# Altium project XDS100v3.PrjPcb
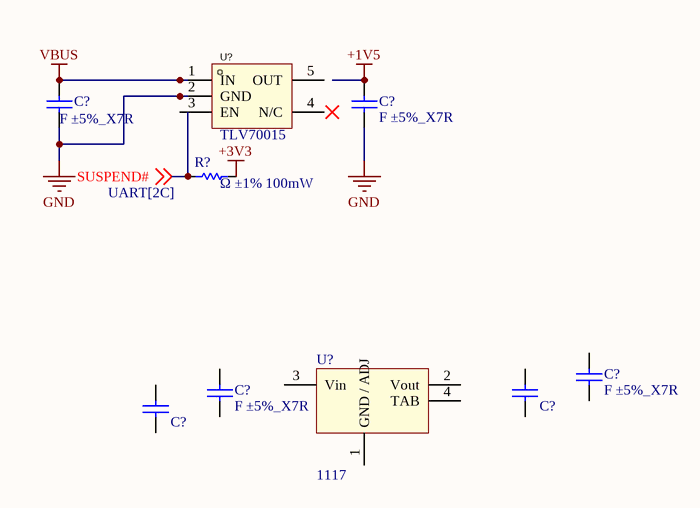
[diagram p0: Power.SchDoc]
5 sheets, 102 parts. Net scope: global (net labels, ports and power ports of the same name join across sheets).
Board file: XDS100v3.PcbDoc
Sheets:
  Power.SchDoc
  FPGA.SchDoc
  UART.SchDoc
  Port.SchDoc
  Others.SchDoc

## Sheet Power.SchDoc
size A4; SheetNumber: 1; SheetTotal: 5; SPICEModelCacheEWVEJELR: <root> / <DocumentId>EWVEJELR</DocumentId> / <CacheFrame Number="0"> / <Model Name="865250140002_22uf" Kind="CKT"> / <Text>******* / .subckt 865250140002_22uF 1 2 / Rser 1 3 2.79274851491 / Lser 2 4 9.31010869E-10 / C1 3 4 0.000022 / Rpar 3 4 2100000 / .ends 865250140002_22uF</Text> / </Model> / <Model Name="865250240001_10uf" Kind="CKT"> / <Text>******* / .subckt 865250240001_10uF 1 2 / Rser 1 3 1.93839512911 / Lser 2 4 8.46868376E-10 / C1 3 4 0.00001 / Rpar 3 4 3333333.33333333 / .ends 865250240001_10uF</Text> / </Model> / </CacheFrame> / </root>

### Parts
(Parts that share a designator on the sheet are numbered #1, #2 ... from top to bottom, then left to right.)
C?#1  F ±5%_X7R  [C0805]
C?#2  F ±5%_X7R  [C0805]
C?#3  F ±5%_X7R  [C0805]
C?#4  F ±5%_X7R  [C0805]
C?#5  22µF  [WCAP-ASNP_D4H5.5]  (value not drawn)
C?#6  10µF  [WCAP-ASNP_D4H5.5]  (value not drawn)
R?#1  Ω ±1% 100mW  [R0603]
U?#1  TLV70015  [SOT-23-5_L2.9-W1.6-P0.95-LS2.8-BR]
U?#2  1117  [SOT-223-3]

### Nets
+1V5: C?#2.2
+3V3: R?#1.1
GND: C?#1.1 C?#2.1 U?#1.2(GND)
VBUS: C?#1.2 U?#1.1(IN)
SUSPEND#: R?#1.2 ; off-sheet SUSPEND#

Not connected (* = marked no-connect by the designer): C?#3 1 2; C?#4 1 2; C?#5 1 2; C?#6 1 2; U?#1 3(EN) 4(N/C) 5(OUT); U?#2 1(GND_/_ADJ) 2(Vout) 3(Vin) 4(TAB)

### Library data of the parts
C?#1-C?#4 = Cap: Capacitor; Published: 8-Jun-2000; LatestRevisionDate: 17-Jul-2002; LatestRevisionNote: Re-released for DXP Platform.; PackageReference: RAD-0.3; Publisher: Altium Limited; PackageDescription: Radial Cap, Thru-Hole; 2 Leads; 0.3 in Pin Spacing
C?#5 = 865250140002: WCAP-ASNP Aluminum Electrolytic Capacitor, V-Chip, SMT, D4 x H5.5mm, 22µF, 6.3V; Manufacturer: Wurth Elektronik; Capacitance Tolerance: +/-20%; Dissipation Factor: 24%; Endurance: 2000h; Leakage Current: 10µA; Ripple Current: 28mA; Technical Reference: ASBB055220M6R3DVCTAB000; Manufacturer Part Number: 865250140002; Category: Aluminum Electrolytic Capacitors; Match Code: WCAP-ASNP; ComponentLink1Description: Website Link; ComponentLink1URL: https://www.we-online.com/redexpert/article/865250140002?ad; ComponentLink2Description: Datasheet Link; ComponentLink2URL: https://www.we-online.com/redexpert/spec/865250140002?ad; Mount: Surface Mount; Operating Temperature Max: 85°C; Operating Temperature Min: -40°C; Packaging: Tape and Reel; Case/Size Code: D4 x H5.5mm; Height: 5.5mm; Diameter: 4mm; Capacitance: 22µF; Rated Voltage (DC): 6.3V
C?#6 = 865250240001: WCAP-ASNP Aluminum Electrolytic Capacitor, V-Chip, SMT, D4 x H5.5mm, 10µF, 10V; Manufacturer: Wurth Elektronik; Capacitance Tolerance: +/-20%; Dissipation Factor: 20%; Endurance: 2000h; Leakage Current: 10µA; Ripple Current: 17mA; Technical Reference: ASBB055100M010DVCTAB000; Manufacturer Part Number: 865250240001; Category: Aluminum Electrolytic Capacitors; Match Code: WCAP-ASNP; ComponentLink1Description: Website Link; ComponentLink1URL: https://www.we-online.com/redexpert/article/865250240001?ad; ComponentLink2Description: Datasheet Link; ComponentLink2URL: https://www.we-online.com/redexpert/spec/865250240001?ad; Mount: Surface Mount; Operating Temperature Max: 85°C; Operating Temperature Min: -40°C; Packaging: Tape and Reel; Case/Size Code: D4 x H5.5mm; Height: 5.5mm; Diameter: 4mm; Capacitance: 10µF; Rated Voltage (DC): 10V
R?#1 = Res: Resistor; Published: 8-Jun-2000; LatestRevisionDate: 17-Jul-2002; LatestRevisionNote: Re-released for DXP Platform.; PackageReference: AXIAL-0.3; Publisher: Altium Limited; PackageDescription: Axial Device, Thru-Hole; 2 Leads; 0.3 in Pin Spacing
U?#1 = TLV70015: Manufacturer: TI(德州仪器); Name: TLV70015DDCR; Add into BOM: yes; Output Type: 固定; Output Polarity: 正; Number of Outputs: 1; Maximum Input Voltage: 5.5V; Output Voltage: 1.5V; Dropout Voltage: 250mV@(200mA); Quiescent Current (Ground Current): 55uA; Output Current: 200mA; Power Supply Rejection Ratio (PSRR): 68dB@(1kHz); Symbol: TLV70015DDCR; Device: TLV70015DDCR; LCSC Part Name: TLV70015DDCR; Supplier Part: C2865100; Manufacturer Part: TLV70015DDCR; Supplier Footprint: SOT-23-Thin-5; JLCPCB Part Class: Extended Part; Datasheet: https://atta.szlcsc.com/upload/public/pdf/source/20230221/CBA3FAF2ECD8317094AE1D26AA0CA23B.pdf; Supplier: LCSC; Convert to PCB: yes; Operating Temperature: -40℃~+125℃@(Tj)

## Sheet FPGA.SchDoc
size A4; SheetNumber: 2; SheetTotal: 5
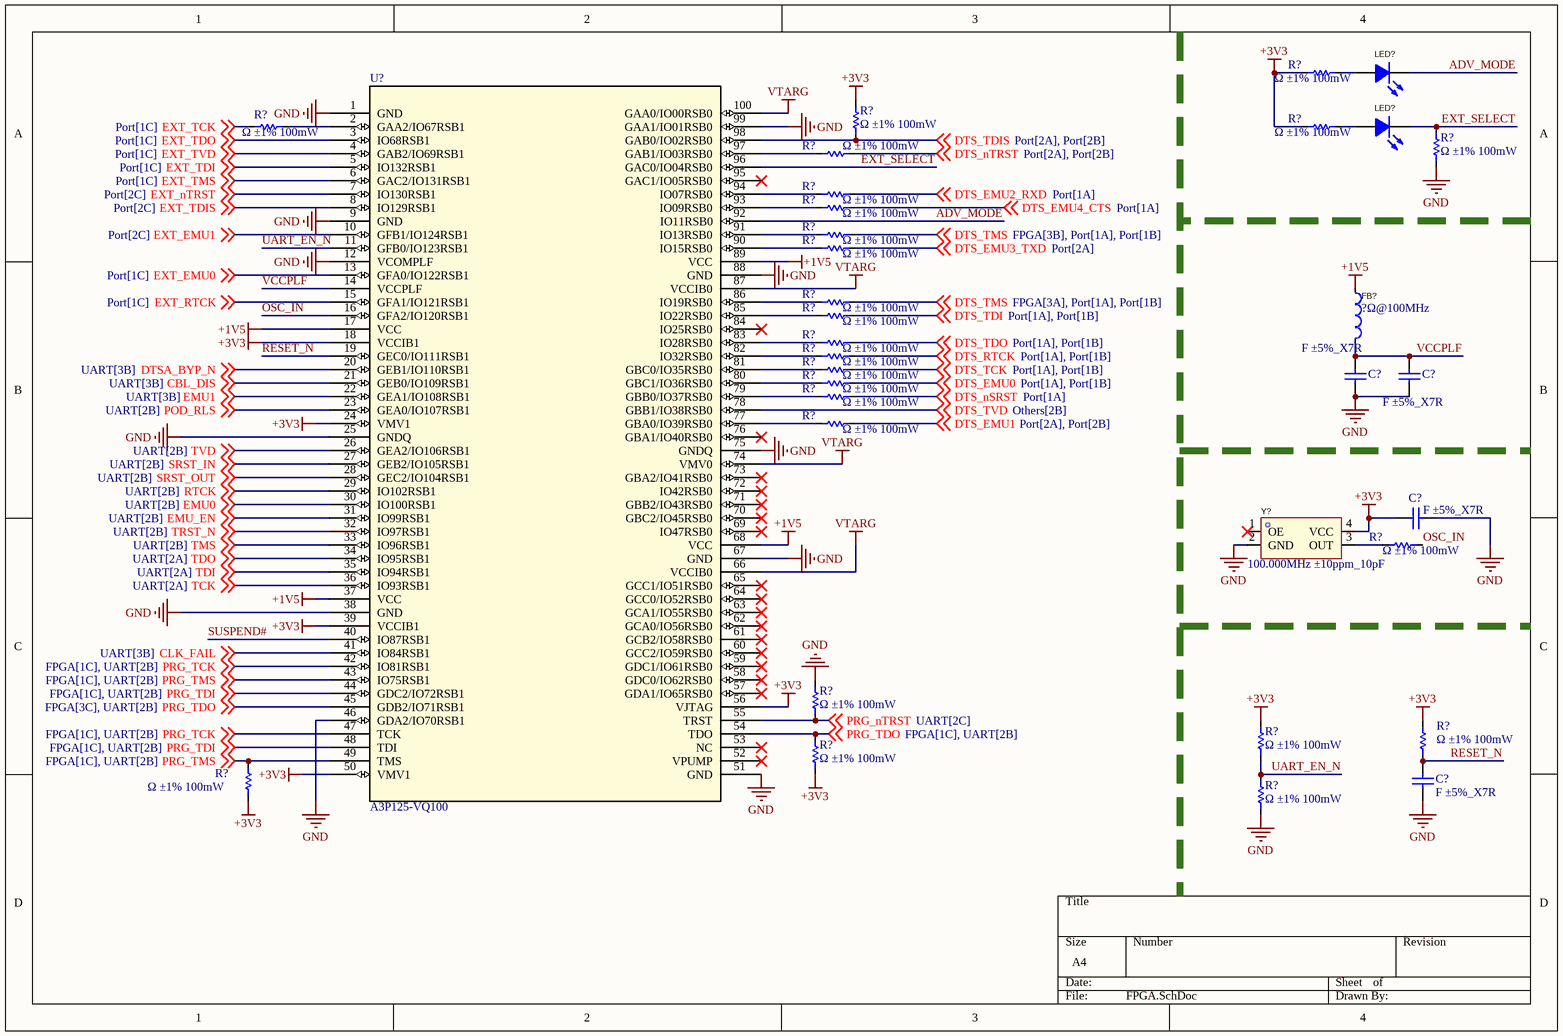
[diagram p1: FPGA.SchDoc]

### Parts
(Parts that share a designator on the sheet are numbered #1, #2 ... from top to bottom, then left to right.)
C?#7  F ±5%_X7R  [C0805]
C?#8  F ±5%_X7R  [C0805]
C?#9  F ±5%_X7R  [C0805]
C?#10  F ±5%_X7R  [C0805]
FB?#1  ?Ω@100MHz  [L0603]
LED?#1  LED  [LED0603-RD]  (value not drawn)
LED?#2  LED  [LED0603-RD]  (value not drawn)
R?#2  Ω ±1% 100mW  [R0603]
R?#3  Ω ±1% 100mW  [R0603]
R?#4  Ω ±1% 100mW  [R0603]
R?#5  Ω ±1% 100mW  [R0603]
R?#6  Ω ±1% 100mW  [R0603]
R?#7  Ω ±1% 100mW  [R0603]
R?#8  Ω ±1% 100mW  [R0603]
R?#9  Ω ±1% 100mW  [R0603]
R?#10  Ω ±1% 100mW  [R0603]
R?#11  Ω ±1% 100mW  [R0603]
R?#12  Ω ±1% 100mW  [R0603]
R?#13  Ω ±1% 100mW  [R0603]
R?#14  Ω ±1% 100mW  [R0603]
R?#15  Ω ±1% 100mW  [R0603]
R?#16  Ω ±1% 100mW  [R0603]
R?#17  Ω ±1% 100mW  [R0603]
R?#18  Ω ±1% 100mW  [R0603]
R?#19  Ω ±1% 100mW  [R0603]
R?#20  Ω ±1% 100mW  [R0603]
R?#21  Ω ±1% 100mW  [R0603]
R?#22  Ω ±1% 100mW  [R0603]
R?#23  Ω ±1% 100mW  [R0603]
R?#24  Ω ±1% 100mW  [R0603]
R?#25  Ω ±1% 100mW  [R0603]
R?#26  Ω ±1% 100mW  [R0603]
U?#3  A3P125-VQ100  [VQ100_MCH]
Y?  100.000MHz ±10ppm_10pF  [OSC-SMD_4P-L3.2-W2.5-BL_SIT8008BI]

### Nets
+1V5: FB?#1.1 U?#3.17(VCC) U?#3.37(VCC) U?#3.68(VCC) U?#3.89(VCC)
+3V3: C?#9.1 R?#2.1 R?#3.1 R?#4.2 R?#22.2 R?#23.2 R?#24.2 R?#25.1 U?#3.18(VCCIB1) U?#3.24(VMV1) U?#3.39(VCCIB1) U?#3.50(VMV1) U?#3.56(VJTAG) Y?.4(VCC)
GND: C?#7.1 C?#8.1 C?#9.2 C?#10.1 R?#7.1 R?#21.2 R?#26.1 U?#3.1(GND) U?#3.9(GND) U?#3.12(VCOMPLF) U?#3.25(GNDQ) U?#3.38(GND) U?#3.46(GDA2/IO70RSB1) U?#3.51(GND) U?#3.67(GND) U?#3.75(GNDQ) U?#3.88(GND) U?#3.99(GAA1/IO01RSB0) Y?.2(GND)
VTARG: U?#3.66(VCCIB0) U?#3.74(VMV0) U?#3.87(VCCIB0) U?#3.100(GAA0/IO00RSB0)
ADV_MODE: LED?#1.2(K) U?#3.92(IO11RSB0)
CBL_DIS: U?#3.21(GEB0/IO109RSB1) ; off-sheet CBL_DIS
CLK_FAIL: U?#3.41(IO84RSB1) ; off-sheet CLK_FAIL
DTS_EMU0: R?#17.2 ; off-sheet DTS_EMU0
DTS_EMU1: R?#19.2 ; off-sheet DTS_EMU1
DTS_EMU2_RXD: R?#8.2 ; off-sheet DTS_EMU2_RXD
DTS_EMU3_TXD: R?#11.2 ; off-sheet DTS_EMU3_TXD
DTS_EMU4_CTS: R?#9.2 ; off-sheet DTS_EMU4_CTS
DTS_nSRST: R?#18.2 ; off-sheet DTS_nSRST
DTS_nTRST: R?#6.2 ; off-sheet DTS_nTRST
DTS_RTCK: R?#15.2 ; off-sheet DTS_RTCK
DTS_TCK: R?#16.2 ; off-sheet DTS_TCK
DTS_TDI: R?#13.2 ; off-sheet DTS_TDI
DTS_TDIS: R?#4.1 U?#3.98(GAB0/IO02RSB0) ; off-sheet DTS_TDIS
DTS_TDO: R?#14.2 ; off-sheet DTS_TDO
DTS_TMS: R?#10.2 R?#12.2 ; off-sheet DTS_TMS
DTS_TVD: U?#3.78(GBB1/IO38RSB0) ; off-sheet DTS_TVD
DTSA_BYP_N: U?#3.20(GEB1/IO110RSB1) ; off-sheet DTSA_BYP_N
EMU0: U?#3.30(IO100RSB1) ; off-sheet EMU0
EMU1: U?#3.22(GEA1/IO108RSB1) ; off-sheet EMU1
EMU_EN: U?#3.31(IO99RSB1) ; off-sheet EMU_EN
EXT_EMU0: U?#3.13(GFA0/IO122RSB1) ; off-sheet EXT_EMU0
EXT_EMU1: U?#3.10(GFB1/IO124RSB1) ; off-sheet EXT_EMU1
EXT_nTRST: U?#3.7(IO130RSB1) ; off-sheet EXT_nTRST
EXT_RTCK: U?#3.15(GFA1/IO121RSB1) ; off-sheet EXT_RTCK
EXT_SELECT: LED?#2.2(K) R?#7.2 U?#3.96(GAC0/IO04RSB0)
EXT_TCK: R?#5.2 ; off-sheet EXT_TCK
EXT_TDI: U?#3.5(IO132RSB1) ; off-sheet EXT_TDI
EXT_TDIS: U?#3.8(IO129RSB1) ; off-sheet EXT_TDIS
EXT_TDO: U?#3.3(IO68RSB1) ; off-sheet EXT_TDO
EXT_TMS: U?#3.6(GAC2/IO131RSB1) ; off-sheet EXT_TMS
EXT_TVD: U?#3.4(GAB2/IO69RSB1) ; off-sheet EXT_TVD
OSC_IN: R?#20.1 U?#3.16(GFA2/IO120RSB1)
POD_RLS: U?#3.23(GEA0/IO107RSB1) ; off-sheet POD_RLS
PRG_nTRST: R?#21.1 U?#3.55(TRST) ; off-sheet PRG_nTRST
PRG_TCK: U?#3.42(IO81RSB1) U?#3.47(TCK) ; off-sheet PRG_TCK
PRG_TDI: U?#3.44(GDC2/IO72RSB1) U?#3.48(TDI) ; off-sheet PRG_TDI
PRG_TDO: R?#22.1 U?#3.45(GDB2/IO71RSB1) U?#3.54(TDO) ; off-sheet PRG_TDO
PRG_TMS: R?#25.2 U?#3.43(IO75RSB1) U?#3.49(TMS) ; off-sheet PRG_TMS
RESET_N: C?#10.2 R?#24.1 U?#3.19(GEC0/IO111RSB1)
RTCK: U?#3.29(IO102RSB1) ; off-sheet RTCK
SRST_IN: U?#3.27(GEB2/IO105RSB1) ; off-sheet SRST_IN
SRST_OUT: U?#3.28(GEC2/IO104RSB1) ; off-sheet SRST_OUT
SUSPEND#: U?#3.40(IO87RSB1)
TCK: U?#3.36(IO93RSB1) ; off-sheet TCK
TDI: U?#3.35(IO94RSB1) ; off-sheet TDI
TDO: U?#3.34(IO95RSB1) ; off-sheet TDO
TMS: U?#3.33(IO96RSB1) ; off-sheet TMS
TRST_N: U?#3.32(IO97RSB1) ; off-sheet TRST_N
TVD: U?#3.26(GEA2/IO106RSB1) ; off-sheet TVD
UART_EN_N: R?#23.1 R?#26.2 U?#3.11(GFB0/IO123RSB1)
VCCPLF: C?#7.2 C?#8.2 FB?#1.2 U?#3.14(VCCPLF)
NetLED?#1_1: LED?#1.1(A) R?#2.2
NetLED?#2_1: LED?#2.1(A) R?#3.2
NetR?#5_1: R?#5.1 U?#3.2(GAA2/IO67RSB1)
NetR?#6_1: R?#6.1 U?#3.97(GAB1/IO03RSB0)
NetR?#8_1: R?#8.1 U?#3.94(IO07RSB0)
NetR?#9_1: R?#9.1 U?#3.93(IO09RSB0)
NetR?#10_1: R?#10.1 U?#3.91(IO13RSB0)
NetR?#11_1: R?#11.1 U?#3.90(IO15RSB0)
NetR?#12_1: R?#12.1 U?#3.86(IO19RSB0)
NetR?#13_1: R?#13.1 U?#3.85(IO22RSB0)
NetR?#14_1: R?#14.1 U?#3.83(IO28RSB0)
NetR?#15_1: R?#15.1 U?#3.82(IO32RSB0)
NetR?#16_1: R?#16.1 U?#3.81(GBC0/IO35RSB0)
NetR?#17_1: R?#17.1 U?#3.80(GBC1/IO36RSB0)
NetR?#18_1: R?#18.1 U?#3.79(GBB0/IO37RSB0)
NetR?#19_1: R?#19.1 U?#3.77(GBA0/IO39RSB0)
NetR?#20_2: R?#20.2 Y?.3(OUT)

Not connected (* = marked no-connect by the designer): U?#3 52(VPUMP)* 53(NC)* 57(GDA1/IO65RSB0)* 58(GDC0/IO62RSB0)* 59(GDC1/IO61RSB0)* 60(GCC2/IO59RSB0)* 61(GCB2/IO58RSB0)* 62(GCA0/IO56RSB0)* 63(GCA1/IO55RSB0)* 64(GCC0/IO52RSB0)* 65(GCC1/IO51RSB0)* 69(IO47RSB0)* 70(GBC2/IO45RSB0)* 71(GBB2/IO43RSB0)* 72(IO42RSB0)* 73(GBA2/IO41RSB0)* 76(GBA1/IO40RSB0)* 84(IO25RSB0)* 95(GAC1/IO05RSB0)*; Y? 1(OE)*

### Library data of the parts
C?#7-C?#10 = Cap: Capacitor; Published: 8-Jun-2000; LatestRevisionDate: 17-Jul-2002; LatestRevisionNote: Re-released for DXP Platform.; PackageReference: RAD-0.3; Publisher: Altium Limited; PackageDescription: Radial Cap, Thru-Hole; 2 Leads; 0.3 in Pin Spacing
FB?#1 = Ferrite Bead: 标称阻抗@测试频率:600Ω@100MHz;误差:±25%;直流电阻(RDC):250mΩ;额定电流:2A; Manufacturer: FH(风华); Name: CBW321609U601T; Add into BOM: yes; Tolerance: ±25%; DC Resistance: 250mΩ; Current Rating: 2A; Circuits: 1; Symbol: CBW321609U601T; Device: CBW321609U601T; LCSC Part Name: 600Ω@100MHz ±25%; Supplier Part: C73732; Manufacturer Part: CBW321609U601T; Supplier Footprint: SMD; JLCPCB Part Class: Extended Part; Datasheet: https://atta.szlcsc.com/upload/public/pdf/source/20160606/1465200211209.pdf; Supplier: LCSC; Convert to PCB: yes; Impedance @ Frequency: 600Ω@100MHz
LED?#1 LED?#2 = LED: 发光颜色:; Manufacturer: EVERLIGHT(亿光); Name: 17-21SURC/S530-A2/TR8; Add into BOM: yes; Emitted Color: 红灯; Symbol: 17-21SURC/S530-A2/TR8; Device: 17-21SURC/S530-A2/TR8; LCSC Part Name: 红灯; Supplier Part: C131244; Manufacturer Part: 17-21SURC/S530-A2/TR8; Supplier Footprint: 0805; JLCPCB Part Class: Extended Part; Datasheet: https://atta.szlcsc.com/upload/public/pdf/source/20170918/C131244_1505726880590976254.pdf; Supplier: LCSC; Convert to PCB: yes
R?#2-R?#26 = Res: Resistor; Published: 8-Jun-2000; LatestRevisionDate: 17-Jul-2002; LatestRevisionNote: Re-released for DXP Platform.; PackageReference: AXIAL-0.3; Publisher: Altium Limited; PackageDescription: Axial Device, Thru-Hole; 2 Leads; 0.3 in Pin Spacing
U?#3 = A3P125-VQ100: https://www.microchip.com/en-us/product/A3P125#; Mfr_Name: Microchip; RefDes: RefDes; Type: Type
Y? = oscillator: Manufacturer: EPSON(爱普生); Name: 100MHz; Symbol: SG-8101CE-100.000000MHZ-TCHPA; Device: SG-8101CE 100.000000MHz TCHPA; Add into BOM: yes; Value: 100MHz; Frequency Stability: ±20ppm; Supply Voltage: 1.8V~3.3V; LCSC Part Name: 3225 100MHz 1.8~3.3V 20ppm  OE  SMD_4P -40~+105℃; Supplier Part: C390559; Manufacturer Part: SG-8101CE 100.000000MHz TCHPA; Supplier Footprint: SMD3225-4P; JLCPCB Part Class: Extended Part; Datasheet: https://atta.szlcsc.com/upload/public/pdf/source/20190626/C390559_D0305530A2A3721045533DB4F9788766.pdf; Supplier: LCSC; Convert to PCB: yes; Operating Temperature: -40℃~+105℃

## Sheet UART.SchDoc
size A4; SheetNumber: 3; SheetTotal: 5; SPICEModelCacheEFDJEFTA: <root> / <DocumentId>EFDJEFTA</DocumentId> / <CacheFrame Number="0"> / <Model Name="0603_885012106005_4.7uf" Kind="CKT"> / <Text>******* / .subckt 0603_885012106005_4.7uF 1 2 / Rser 1 3 0.00436564105168 / Lser 2 4 5.20484374E-10 / C1 3 4 0.0000047 / Rpar 3 4 10000000 / .ends 0603_885012106005_4.7uF</Text> / </Model> / </CacheFrame> / </root>
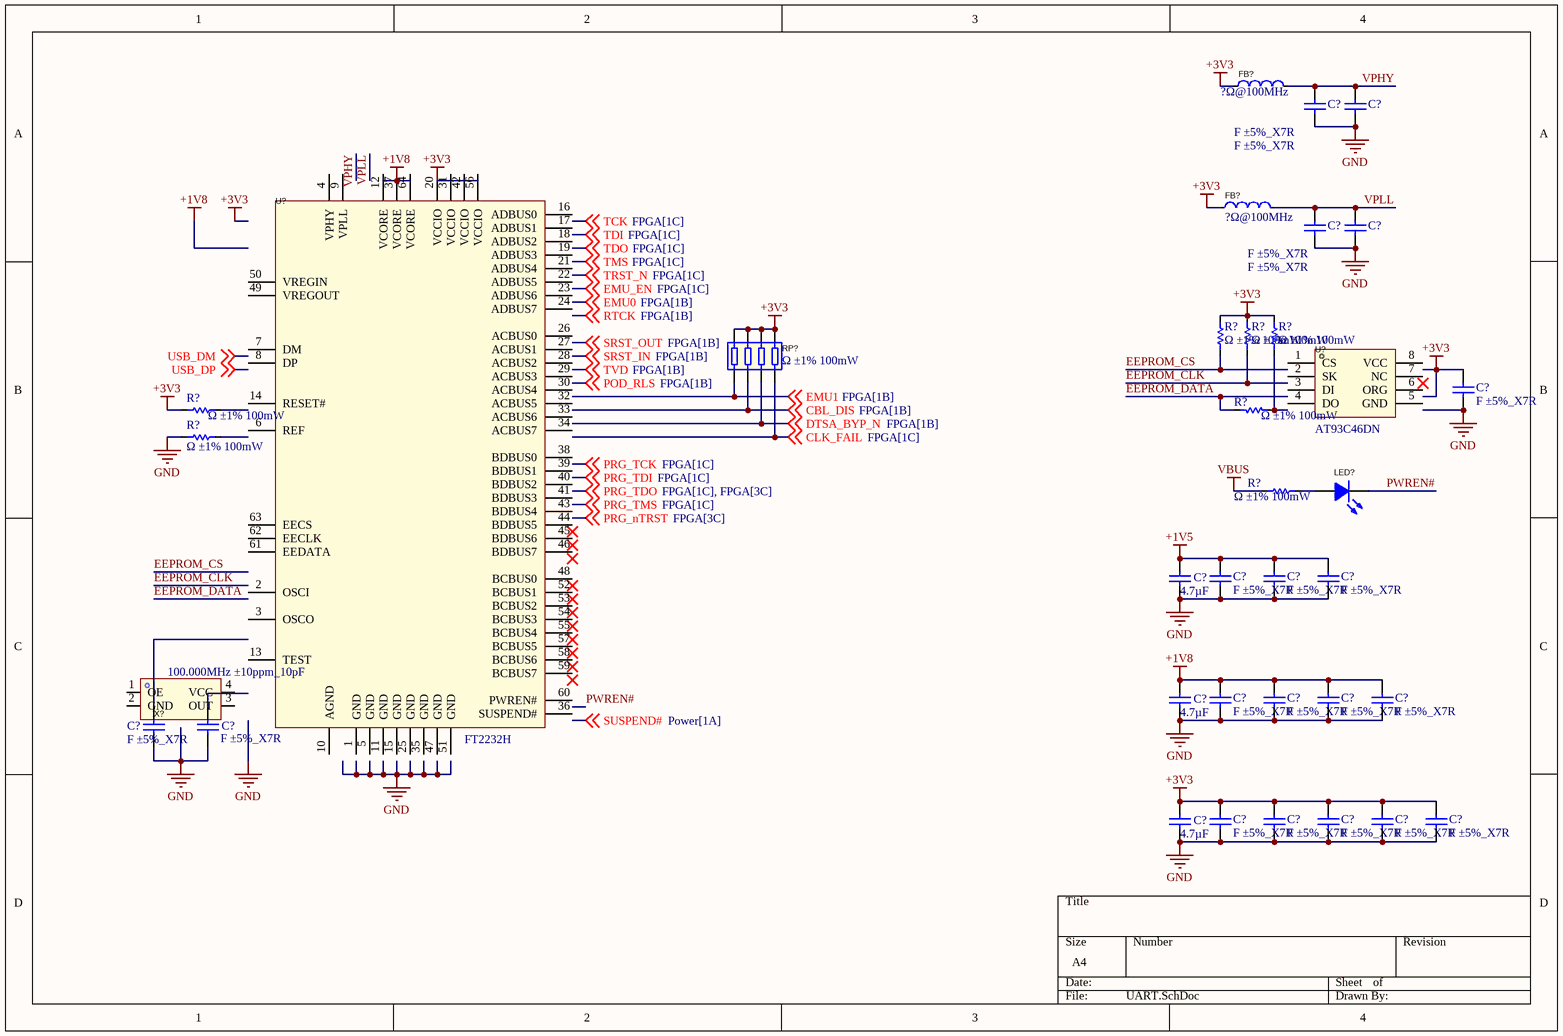
[diagram p2: UART.SchDoc]

### Parts
(Parts that share a designator on the sheet are numbered #1, #2 ... from top to bottom, then left to right.)
C?#11  F ±5%_X7R  [C0805]
C?#12  F ±5%_X7R  [C0805]
C?#13  F ±5%_X7R  [C0805]
C?#14  F ±5%_X7R  [C0805]
C?#15  F ±5%_X7R  [C0805]
C?#16  F ±5%_X7R  [C0805]
C?#17  F ±5%_X7R  [C0805]
C?#18  F ±5%_X7R  [C0805]
C?#19  4.7µF  [WCAP-CSGP_0603_L1.6W0.8H0.8_Reflow]
C?#20  F ±5%_X7R  [C0805]
C?#21  F ±5%_X7R  [C0805]
C?#22  F ±5%_X7R  [C0805]
C?#23  F ±5%_X7R  [C0805]
C?#24  4.7µF  [WCAP-CSGP_0603_L1.6W0.8H0.8_Reflow]
C?#25  F ±5%_X7R  [C0805]
C?#26  F ±5%_X7R  [C0805]
C?#27  F ±5%_X7R  [C0805]
C?#28  F ±5%_X7R  [C0805]
C?#29  F ±5%_X7R  [C0805]
C?#30  F ±5%_X7R  [C0805]
C?#31  F ±5%_X7R  [C0805]
C?#32  4.7µF  [WCAP-CSGP_0603_L1.6W0.8H0.8_Reflow]
FB?#2  ?Ω@100MHz  [L0603]
FB?#3  ?Ω@100MHz  [L0603]
LED?#3  LED  [LED0603-RD]  (value not drawn)
R?#27  Ω ±1% 100mW  [R0603]
R?#28  Ω ±1% 100mW  [R0603]
R?#29  Ω ±1% 100mW  [R0603]
R?#30  Ω ±1% 100mW  [R0603]
R?#31  Ω ±1% 100mW  [R0603]
R?#32  Ω ±1% 100mW  [R0603]
R?#33  Ω ±1% 100mW  [R0603]
RP?#1  Ω ±1% 100mW  [RES-ARRAY-SMD_0402-8P-L2.0-W1.0-BL]
U?#4  AT93C46DN  [SOIC-8_L4.9-W3.9-P1.27-LS6.0-BL]
U?#5  FT2232H  [LQFP-64_L10.0-W10.0-P0.50-LS12.0-TL]
X?  100.000MHz ±10ppm_10pF  [OSC-SMD_4P-L3.2-W2.5-BL_SIT8008BI]

### Nets
+1V5: C?#16.2 C?#17.2 C?#18.2 C?#19.2
+1V8: C?#20.2 C?#21.2 C?#22.2 C?#23.2 C?#24.2
+3V3: C?#15.2 C?#27.2 C?#28.2 C?#29.2 C?#30.2 C?#31.2 C?#32.2 FB?#2.1 FB?#3.2 R?#27.2 R?#28.2 R?#29.2 R?#31.2 RP?#1.5 RP?#1.6 RP?#1.7 RP?#1.8
GND: C?#11.1 C?#12.1 C?#13.1 C?#14.1 C?#15.1 C?#16.1 C?#17.1 C?#18.1 C?#19.1 C?#20.1 C?#21.1 C?#22.1 C?#23.1 C?#24.1 C?#25.1 C?#26.1 C?#27.1 C?#28.1 C?#29.1 C?#30.1 C?#31.1 C?#32.1 R?#32.2
VBUS: R?#33.1
CBL_DIS: RP?#1.2 ; off-sheet CBL_DIS
CLK_FAIL: RP?#1.4 ; off-sheet CLK_FAIL
DTSA_BYP_N: RP?#1.3 ; off-sheet DTSA_BYP_N
EEPROM_CLK: R?#28.1
EEPROM_CS: R?#27.1
EEPROM_DATA: R?#30.2
EMU1: RP?#1.1 ; off-sheet EMU1
PWREN#: LED?#3.2(K)
VPHY: C?#11.2 C?#12.2 FB?#2.2
VPLL: C?#13.2 C?#14.2 FB?#3.1
NetLED?#3_1: LED?#3.1(A) R?#33.2
NetR?#29_1: R?#29.1 R?#30.1

Not connected (* = marked no-connect by the designer): C?#25 2; C?#26 2; R?#31 1; R?#32 1; U?#4 1(CS) 2(SK) 3(DI) 4(DO) 5(GND) 6(ORG) 7(NC) 8(VCC); U?#5 1(GND) 2(OSCI) 3(OSCO) 4(VPHY) 5(GND) 6(REF) 7(DM) 8(DP) 9(VPLL) 10(AGND) 11(GND) 12(VCORE) 13(TEST) 14(RESET#) 15(GND) 16(ADBUS0) 17(ADBUS1) 18(ADBUS2) 19(ADBUS3) 20(VCCIO) 21(ADBUS4) 22(ADBUS5) 23(ADBUS6) 24(ADBUS7) 25(GND) 26(ACBUS0) 27(ACBUS1) 28(ACBUS2) 29(ACBUS3) 30(ACBUS4) 31(VCCIO) 32(ACBUS5) 33(ACBUS6) 34(ACBUS7) 35(GND) 36(SUSPEND#) 37(VCORE) 38(BDBUS0) 39(BDBUS1) 40(BDBUS2) 41(BDBUS3) 42(VCCIO) 43(BDBUS4) 44(BDBUS5) 45(BDBUS6) 46(BDBUS7) 47(GND) 48(BCBUS0) 49(VREGOUT) 50(VREGIN) 51(GND) 52(BCBUS1) 53(BCBUS2) 54(BCBUS3) 55(BCBUS4) 56(VCCIO) 57(BCBUS5) 58(BCBUS6) 59(BCBUS7) 60(PWREN#) 61(EEDATA) 62(EECLK) 63(EECS) 64(VCORE); X? 1(OE) 2(GND) 3(OUT) 4(VCC)

### Library data of the parts
C?#11-C?#18 C?#20-C?#23 C?#25-C?#31 = Cap: Capacitor; Published: 8-Jun-2000; LatestRevisionDate: 17-Jul-2002; LatestRevisionNote: Re-released for DXP Platform.; PackageReference: RAD-0.3; Publisher: Altium Limited; PackageDescription: Radial Cap, Thru-Hole; 2 Leads; 0.3 in Pin Spacing
C?#19 C?#24 C?#32 = 885012106005: WCAP-CSGP Multilayer Ceramic Chip Capacitor, General Purpose, size 0603, X5R, 4.7µF, 6.3VDC; Manufacturer: Wurth Elektronik; Case/Size Code: 0603; Capacitance Tolerance: +/-20%; Dissipation Factor: 10%; Insulation Resistance: 0.02GΩ; Rated Voltage (DC): 6.3V; Technical Reference: X5R0603475M6R3DFCT10000; Manufacturer Part Number: 885012106005; Category: Multilayer Ceramic Chip Capacitors; Match Code: WCAP-CSGP; ComponentLink1Description: Website Link; ComponentLink1URL: https://www.we-online.com/redexpert/article/885012106005?ad; ComponentLink2Description: Datasheet Link; ComponentLink2URL: https://www.we-online.com/redexpert/spec/885012106005?ad; Mount: Surface Mount; Operating Temperature Max: 85°C; Operating Temperature Min: -55°C; Packaging: Tape and Reel; Length: 1.6mm; Width: 0.8mm; Height: 0.8mm; Capacitance: 4.7µF; Ceramic Type: X5R
FB?#2 FB?#3 = Ferrite Bead: as FB?#1 on sheet FPGA; Symbol: CBW321609U601T; Device: CBW321609U601T; LCSC Part Name: 600Ω@100MHz ±25%; Supplier Part: C73732; Manufacturer Part: CBW321609U601T; Supplier Footprint: SMD; JLCPCB Part Class: Extended Part; Datasheet: https://atta.szlcsc.com/upload/public/pdf/source/20160606/1465200211209.pdf; Supplier: LCSC; Convert to PCB: yes; Impedance @ Frequency: 600Ω@100MHz
LED?#3 = LED: as LED?#1 on sheet FPGA; Symbol: 17-21SURC/S530-A2/TR8; Device: 17-21SURC/S530-A2/TR8; LCSC Part Name: 红灯; Supplier Part: C131244; Manufacturer Part: 17-21SURC/S530-A2/TR8; Supplier Footprint: 0805; JLCPCB Part Class: Extended Part; Datasheet: https://atta.szlcsc.com/upload/public/pdf/source/20170918/C131244_1505726880590976254.pdf; Supplier: LCSC; Convert to PCB: yes
R?#27-R?#33 = Res: Resistor; Published: 8-Jun-2000; LatestRevisionDate: 17-Jul-2002; LatestRevisionNote: Re-released for DXP Platform.; PackageReference: AXIAL-0.3; Publisher: Altium Limited; PackageDescription: Axial Device, Thru-Hole; 2 Leads; 0.3 in Pin Spacing
RP?#1 = RP: Manufacturer: YAGEO(国巨); Name: 30Ω; Symbol: YC124-JR-0730RL; Add into BOM: yes; Value: 30Ω; Tolerance: ±5%; Power(Watts): 62.5mW; Number of Resistors: 4; Temperature Coefficient: ±200ppm/℃; Device: YC124-JR-0730RL; LCSC Part Name: 30Ω ±5% 0402x4; Supplier Part: C136847; Manufacturer Part: YC124-JR-0730RL; Supplier Footprint: 0402x4; JLCPCB Part Class: Extended Part; Datasheet: https://atta.szlcsc.com/upload/public/pdf/source/20171116/C136847_15108221195481123713.pdf; Supplier: LCSC; Convert to PCB: yes; Number of Pins: 8
U?#4 = AT93C46DN: Manufacturer: MICROCHIP(美国微芯); Name: AT93C46DN-SH-T; Add into BOM: yes; Interface Type: SPI; Memory Size: 1Kbit; Supply Voltage: 1.8V~5.5V; Symbol: AT93C46DN-SH-T; Device: AT93C46DN-SH-T; LCSC Part Name: AT93C46DN-SH-T; Supplier Part: C6499; Manufacturer Part: AT93C46DN-SH-T; Supplier Footprint: SOP-8; JLCPCB Part Class: Extended Part; Datasheet: https://atta.szlcsc.com/upload/public/pdf/source/20210201/C6499_C0D2958C2C3F034123F82B64259CD392.pdf; Supplier: LCSC; Convert to PCB: yes; Operating Temperature: -40℃~+85℃
U?#5 = FT2232H: Manufacturer: FTDI(飞特帝亚); Name: FT2232HL-REEL; Symbol: FT2232HL; Add into BOM: yes; Device: FT2232HL-REEL; LCSC Part Name: FT2232HL-REEL; Supplier Part: C27882; Manufacturer Part: FT2232HL-REEL; Supplier Footprint: LQFP-64(10x10); JLCPCB Part Class: Extended Part; Datasheet: https://atta.szlcsc.com/upload/public/pdf/source/20140319/1457707024994.pdf; Supplier: LCSC; Convert to PCB: yes; Type: -; Protocol: -; Number of Drivers/Receivers: -; Data Rate: -; Supply Voltage: -
X? = oscillator: Manufacturer: EPSON(爱普生); Frequency Stability: ±20ppm; Name: 100MHz; Symbol: SG-8101CE-100.000000MHZ-TCHPA; Device: SG-8101CE 100.000000MHz TCHPA; Add into BOM: yes; Value: 100MHz; Supply Voltage: 1.8V~3.3V; Operating Temperature: -40℃~+105℃; LCSC Part Name: 3225 100MHz 1.8~3.3V 20ppm  OE  SMD_4P -40~+105℃; Supplier Part: C390559; Manufacturer Part: SG-8101CE 100.000000MHz TCHPA; Supplier Footprint: SMD3225-4P; JLCPCB Part Class: Extended Part; Datasheet: https://atta.szlcsc.com/upload/public/pdf/source/20190626/C390559_D0305530A2A3721045533DB4F9788766.pdf; Supplier: LCSC; Convert to PCB: yes

## Sheet Port.SchDoc
size A4; SheetNumber: 4; SheetTotal: 5
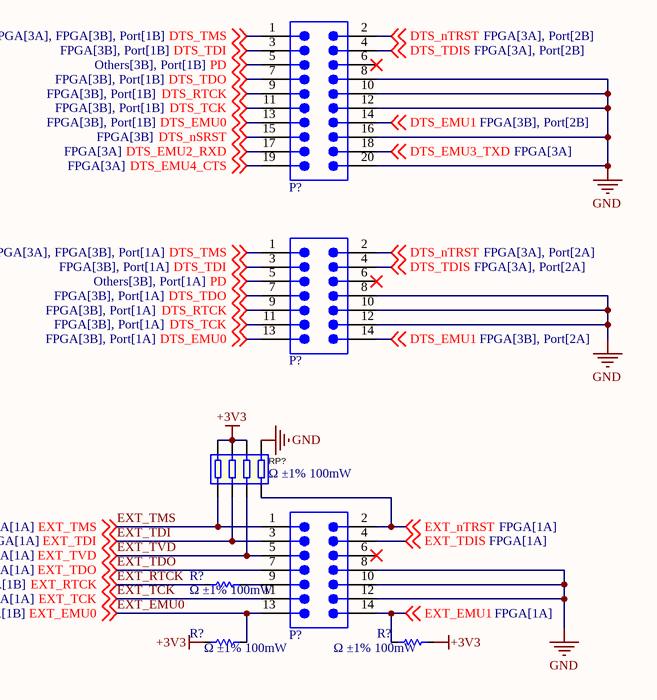
[diagram p3: Port.SchDoc]

### Parts
(Parts that share a designator on the sheet are numbered #1, #2 ... from top to bottom, then left to right.)
P?#1  61202021721  [61202021721]  (value not drawn)
P?#2  61201421621  [61201421621]  (value not drawn)
P?#3  61201421621  [61201421621]  (value not drawn)
R?#34  Ω ±1% 100mW  [R0603]
R?#35  Ω ±1% 100mW  [R0603]
R?#36  Ω ±1% 100mW  [R0603]
RP?#2  Ω ±1% 100mW  [RES-ARRAY-SMD_0402-8P-L2.0-W1.0-BL]

### Nets
+3V3: R?#35.1 R?#36.2 RP?#2.6 RP?#2.7 RP?#2.8
GND: P?#1.8 P?#1.10 P?#1.12 P?#1.16 P?#1.20 P?#2.8 P?#2.10 P?#2.12 P?#3.8 P?#3.10 P?#3.12 RP?#2.5
DTS_EMU0: P?#1.13 P?#2.13 ; off-sheet DTS_EMU0
DTS_EMU1: P?#1.14 P?#2.14 ; off-sheet DTS_EMU1
DTS_EMU2_RXD: P?#1.17 ; off-sheet DTS_EMU2_RXD
DTS_EMU3_TXD: P?#1.18 ; off-sheet DTS_EMU3_TXD
DTS_EMU4_CTS: P?#1.19 ; off-sheet DTS_EMU4_CTS
DTS_nSRST: P?#1.15 ; off-sheet DTS_nSRST
DTS_nTRST: P?#1.2 P?#2.2 ; off-sheet DTS_nTRST
DTS_RTCK: P?#1.9 P?#2.9 ; off-sheet DTS_RTCK
DTS_TCK: P?#1.11 P?#2.11 ; off-sheet DTS_TCK
DTS_TDI: P?#1.3 P?#2.3 ; off-sheet DTS_TDI
DTS_TDIS: P?#1.4 P?#2.4 ; off-sheet DTS_TDIS
DTS_TDO: P?#1.7 P?#2.7 ; off-sheet DTS_TDO
DTS_TMS: P?#1.1 P?#2.1 ; off-sheet DTS_TMS
EXT_EMU0: P?#3.13 R?#35.2 ; off-sheet EXT_EMU0
EXT_EMU1: P?#3.14 R?#36.1 ; off-sheet EXT_EMU1
EXT_nTRST: P?#3.2 RP?#2.4 ; off-sheet EXT_nTRST
EXT_RTCK: R?#34.1 ; off-sheet EXT_RTCK
EXT_TCK: P?#3.11 ; off-sheet EXT_TCK
EXT_TDI: P?#3.3 RP?#2.2 ; off-sheet EXT_TDI
EXT_TDIS: P?#3.4 ; off-sheet EXT_TDIS
EXT_TDO: P?#3.7 ; off-sheet EXT_TDO
EXT_TMS: P?#3.1 RP?#2.1 ; off-sheet EXT_TMS
EXT_TVD: P?#3.5 RP?#2.3 ; off-sheet EXT_TVD
PD: P?#1.5 P?#2.5 ; off-sheet PD
NetP?#3_9: P?#3.9 R?#34.2

Not connected (* = marked no-connect by the designer): P?#1 6*; P?#2 6*; P?#3 6*

### Library data of the parts
P?#1 = 61202021721: WR-BHD Male Box Header, THT Right Angle, pitch 2.54mm, 2 Row, 20 pin; Manufacturer: Wurth Elektronik; Contact Resistance: 20mOhm; Insulation Resistance: 1000MOhm; Rated Current: 3A; Working Voltage: 250V; Withstanding Voltage: 500V; Manufacturer Part Number: 61202021721; Category: Wire-to-Board Connectors; Match Code: WR-BHD; ComponentLink1Description: Website Link; ComponentLink1URL: https://www.we-online.com/redexpert/article/61202021721?ad; ComponentLink2Description: Datasheet Link; ComponentLink2URL: https://www.we-online.com/redexpert/spec/61202021721?ad; Mount: Through Hole; Operating Temperature Max: 105°C; Operating Temperature Min: -40°C; Packaging: Tray; Length: 33.06mm; Width: 13.23mm; Height: 9.1mm; Gender: Male; Number of Pins: 20; Number of Rows: 2; Orientation: Right Angle; Pitch: 2.54mm
P?#2 P?#3 = 61201421621: WR-BHD Male Box Header, THT Straight, pitch 2.54mm, 2 Row, 14 pin; Manufacturer: Wurth Elektronik; Contact Resistance: 20mOhm; Insulation Resistance: 1000MOhm; Rated Current: 3A; Working Voltage: 250V; Withstanding Voltage: 500V; Manufacturer Part Number: 61201421621; Category: Wire-to-Board Connectors; Match Code: WR-BHD; ComponentLink1Description: Website Link; ComponentLink1URL: https://www.we-online.com/redexpert/article/61201421621?ad; ComponentLink2Description: Datasheet Link; ComponentLink2URL: https://www.we-online.com/redexpert/spec/61201421621?ad; Mount: Through Hole; Operating Temperature Max: 105°C; Operating Temperature Min: -40°C; Packaging: Tray; Length: 25.44mm; Width: 9.1mm; Height: 9.1mm; Gender: Male; Number of Pins: 14; Number of Rows: 2; Orientation: Straight; Pitch: 2.54mm
R?#34-R?#36 = Res: Resistor; Published: 8-Jun-2000; LatestRevisionDate: 17-Jul-2002; LatestRevisionNote: Re-released for DXP Platform.; PackageReference: AXIAL-0.3; Publisher: Altium Limited; PackageDescription: Axial Device, Thru-Hole; 2 Leads; 0.3 in Pin Spacing
RP?#2 = RP: as RP?#1 on sheet UART; Device: YC124-JR-0730RL; LCSC Part Name: 30Ω ±5% 0402x4; Supplier Part: C136847; Manufacturer Part: YC124-JR-0730RL; Supplier Footprint: 0402x4; JLCPCB Part Class: Extended Part; Datasheet: https://atta.szlcsc.com/upload/public/pdf/source/20171116/C136847_15108221195481123713.pdf; Supplier: LCSC; Convert to PCB: yes; Number of Pins: 8

## Sheet Others.SchDoc
size A4; SheetNumber: 5; SheetTotal: 5
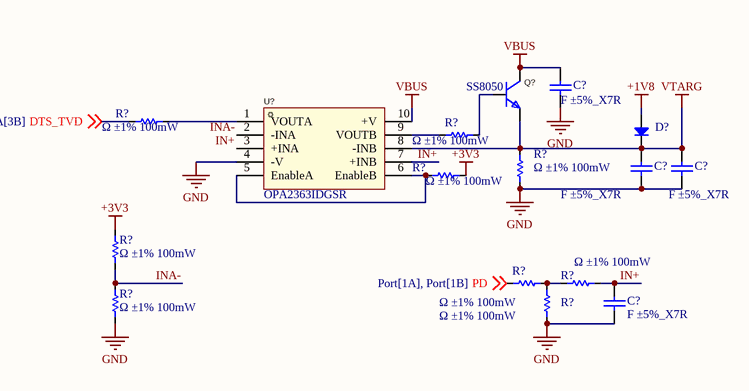
[diagram p4: Others.SchDoc]

### Parts
(Parts that share a designator on the sheet are numbered #1, #2 ... from top to bottom, then left to right.)
C?#33  F ±5%_X7R  [C0805]
C?#34  F ±5%_X7R  [C0805]
C?#35  F ±5%_X7R  [C0805]
C?#36  F ±5%_X7R  [C0805]
D?  1N4148  [SOD-523F]  (value not drawn)
Q?  SS8050  [SOT-23-3_L2.9-W1.6-P1.90-LS2.8-BR]
R?#37  Ω ±1% 100mW  [R0603]
R?#38  Ω ±1% 100mW  [R0603]
R?#39  Ω ±1% 100mW  [R0603]
R?#40  Ω ±1% 100mW  [R0603]
R?#41  Ω ±1% 100mW  [R0603]
R?#42  Ω ±1% 100mW  [R0603]
R?#43  Ω ±1% 100mW  [R0603]
R?#44  Ω ±1% 100mW  [R0603]
R?#45  Ω ±1% 100mW  [R0603]
U?#6  OPA2363IDGSR  [VSSOP-10_L3.0-W3.0-P0.50-LS4.9-BL]

### Nets
+1V8: D?.2(A)
+3V3: R?#40.2 R?#41.2
GND: C?#33.1 C?#34.1 C?#35.1 C?#36.1 R?#39.2 R?#44.1 R?#45.1 U?#6.4(-V)
VBUS: C?#33.2 Q?.3(C) U?#6.10(+V)
VTARG: C?#34.2 C?#35.2 D?.1(K) Q?.2(E) R?#39.1 U?#6.8(-INB)
DTS_TVD: R?#37.1 ; off-sheet DTS_TVD
IN+: C?#36.2 R?#42.2 U?#6.3(+INA) U?#6.7(+INB)
INA-: R?#41.1 R?#44.2 U?#6.2(-INA)
PD: R?#43.2 ; off-sheet PD
NetQ?_1: Q?.1(B) R?#38.1
NetR?#37_2: R?#37.2 U?#6.1(VOUTA)
NetR?#38_2: R?#38.2 U?#6.9(VOUTB)
NetR?#40_1: R?#40.1 U?#6.5(EnableA) U?#6.6(EnableB)
NetR?#42_1: R?#42.1 R?#43.1 R?#45.2

### Library data of the parts
C?#33-C?#36 = Cap: Capacitor; Published: 8-Jun-2000; LatestRevisionDate: 17-Jul-2002; LatestRevisionNote: Re-released for DXP Platform.; PackageReference: RAD-0.3; Publisher: Altium Limited; PackageDescription: Radial Cap, Thru-Hole; 2 Leads; 0.3 in Pin Spacing
D? = 1N4148: High Conductance Fast Diode; Published: 8-Jun-2000; LatestRevisionDate: 17-Jul-2002; LatestRevisionNote: Re-released for DXP Platform.; DatasheetVersion: 1997; PackageReference: DO-35; Publisher: Altium Limited; PackageDescription: Diode, Axial; Body 3.8 x 1.9 mm (LxDia. max), Lead Dia. 0.53 mm (max); Code_JEDEC: DO-204-AH; ComponentLink1Description: Manufacturer Link; ComponentLink1URL: http://www.fairchildsemi.com/; ComponentLink2Description: Datasheet; ComponentLink2URL: http://www.fairchildsemi.com/ds/1N%2F1N4148.pdf
Q? = SS8050: Manufacturer: CJ(江苏长电/长晶); Symbol: SS8050_C2150; Add into BOM: yes; Transistor Type: NPN; Collector-Emitter Breakdown Voltage (Vceo): 25V; Collector Current (Ic): 1.5A; Power Dissipation (Pd): 300mW; Collector Cut-Off Current (Icbo): 100nA; Collector-Emitter Saturation Voltage (VCE(sat)@Ic,Ib): 500mV@800mA,80mA; DC Current Gain (hFE@Ic,Vce): 200@100mA,1V; Transition Frequency (fT): 100MHz; Name: SS8050; Device: SS8050_C2150; LCSC Part Name: NPN 25V 1.5A Y1 200-350; Supplier Part: C2150; Manufacturer Part: SS8050; Supplier Footprint: SOT-23; JLCPCB Part Class: Basic Part; Datasheet: https://atta.szlcsc.com/upload/public/pdf/source/20230322/AEE86F4B043774EFF80CAEA14A37D9E9.pdf; Supplier: LCSC; Convert to PCB: yes; Operating Temperature: +150℃@(Tj)
R?#37-R?#45 = Res: Resistor; Published: 8-Jun-2000; LatestRevisionDate: 17-Jul-2002; LatestRevisionNote: Re-released for DXP Platform.; PackageReference: AXIAL-0.3; Publisher: Altium Limited; PackageDescription: Axial Device, Thru-Hole; 2 Leads; 0.3 in Pin Spacing
U?#6 = OPA2363: Manufacturer: TI(德州仪器); Add into BOM: yes; Number of Circuits: 2; Gain Bandwidth Product(GBP): 7MHz; Slew Rate(SR): 5V/us; Name: OPA2363IDGSR; Symbol: OPA2363IDGSR; Device: OPA2363IDGSR; LCSC Part Name: OPA2363IDGSR; Supplier Part: C181294; Manufacturer Part: OPA2363IDGSR; Supplier Footprint: VSSOP-10-0.5mm; JLCPCB Part Class: Extended Part; Datasheet: https://atta.szlcsc.com/upload/public/pdf/source/20180227/C181294_15196973833841369920.pdf; Supplier: LCSC; Convert to PCB: yes

## Nets that join several sheets
+1V5: Power (C?#2.2), FPGA (5 pins), UART (C?#16.2 C?#17.2 C?#18.2 C?#19.2)
+1V8: UART (5 pins), Others (D?.2)
+3V3: Power (R?#1.1), FPGA (14 pins), UART (17 pins), Port (5 pins), Others (R?#40.2 R?#41.2)
GND: Power (C?#1.1 C?#2.1 U?#1.2), FPGA (19 pins), UART (23 pins), Port (12 pins), Others (8 pins)
VBUS: Power (C?#1.2 U?#1.1), UART (R?#33.1), Others (C?#33.2 Q?.3 U?#6.10)
VTARG: FPGA (U?#3.66 U?#3.74 U?#3.87 U?#3.100), Others (6 pins)
CBL_DIS: FPGA (U?#3.21), UART (RP?#1.2)
CLK_FAIL: FPGA (U?#3.41), UART (RP?#1.4)
DTS_EMU0: FPGA (R?#17.2), Port (P?#1.13 P?#2.13)
DTS_EMU1: FPGA (R?#19.2), Port (P?#1.14 P?#2.14)
DTS_EMU2_RXD: FPGA (R?#8.2), Port (P?#1.17)
DTS_EMU3_TXD: FPGA (R?#11.2), Port (P?#1.18)
DTS_EMU4_CTS: FPGA (R?#9.2), Port (P?#1.19)
DTS_nSRST: FPGA (R?#18.2), Port (P?#1.15)
DTS_nTRST: FPGA (R?#6.2), Port (P?#1.2 P?#2.2)
DTS_RTCK: FPGA (R?#15.2), Port (P?#1.9 P?#2.9)
DTS_TCK: FPGA (R?#16.2), Port (P?#1.11 P?#2.11)
DTS_TDI: FPGA (R?#13.2), Port (P?#1.3 P?#2.3)
DTS_TDIS: FPGA (R?#4.1 U?#3.98), Port (P?#1.4 P?#2.4)
DTS_TDO: FPGA (R?#14.2), Port (P?#1.7 P?#2.7)
DTS_TMS: FPGA (R?#10.2 R?#12.2), Port (P?#1.1 P?#2.1)
DTS_TVD: FPGA (U?#3.78), Others (R?#37.1)
DTSA_BYP_N: FPGA (U?#3.20), UART (RP?#1.3)
EMU1: FPGA (U?#3.22), UART (RP?#1.1)
EXT_EMU0: FPGA (U?#3.13), Port (P?#3.13 R?#35.2)
EXT_EMU1: FPGA (U?#3.10), Port (P?#3.14 R?#36.1)
EXT_nTRST: FPGA (U?#3.7), Port (P?#3.2 RP?#2.4)
EXT_RTCK: FPGA (U?#3.15), Port (R?#34.1)
EXT_TCK: FPGA (R?#5.2), Port (P?#3.11)
EXT_TDI: FPGA (U?#3.5), Port (P?#3.3 RP?#2.2)
EXT_TDIS: FPGA (U?#3.8), Port (P?#3.4)
EXT_TDO: FPGA (U?#3.3), Port (P?#3.7)
EXT_TMS: FPGA (U?#3.6), Port (P?#3.1 RP?#2.1)
EXT_TVD: FPGA (U?#3.4), Port (P?#3.5 RP?#2.3)
PD: Port (P?#1.5 P?#2.5), Others (R?#43.2)
SUSPEND#: Power (R?#1.2), FPGA (U?#3.40)